# EAGLE design CET_GPS_5_03_22_new_route (EAGLE 9.6.2)
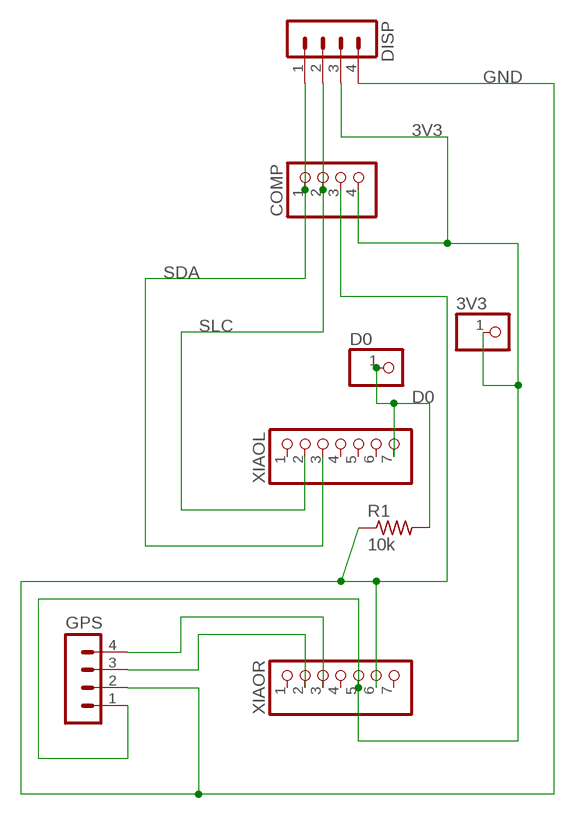
[diagram p0: schematic, sheet 1]

## Parts
3V3  PINHD-1X1  [1X01]
COMP  PINHD-1X4/90  [1X04/90]
D0  PINHD-1X1  [1X01]
DISP  MA04-1  [MA04-1]
GPS  MA04-1  [MA04-1]
R1  10k  R-US_0204/7  [0204/7]
XIAOL  PINHD-1X7  [1X07]
XIAOR  PINHD-1X7  [1X07]

## Nets
3V3: 3V3.1 COMP.4 DISP.3 GPS.1 XIAOR.5
D0: D0.1 R1.2 XIAOL.7
GND: COMP.3 DISP.4 GPS.2 R1.1 XIAOR.6
RX: GPS.3 XIAOR.2
SDA: COMP.1 DISP.1 XIAOL.3
SLC: COMP.2 DISP.2 XIAOL.2
TX: GPS.4 XIAOR.3
Unconnected: XIAOL.1 XIAOL.4 XIAOL.5 XIAOL.6 XIAOR.1 XIAOR.4 XIAOR.7

## Library data of the parts
3V3 D0 = pinhead:PINHD-1X1: PIN HEADER
COMP = pinhead:PINHD-1X4: PIN HEADER
DISP GPS = con-lstb:MA04-1: PIN HEADER; OC_FARNELL: unknown; OC_NEWARK: unknown
R1 = rcl:R-US_: RESISTOR, American symbol; SPICEPREFIX: R
XIAOL XIAOR = pinhead:PINHD-1X7: PIN HEADER

## Net classes
0 default: clearance 0.205 mm

## Board
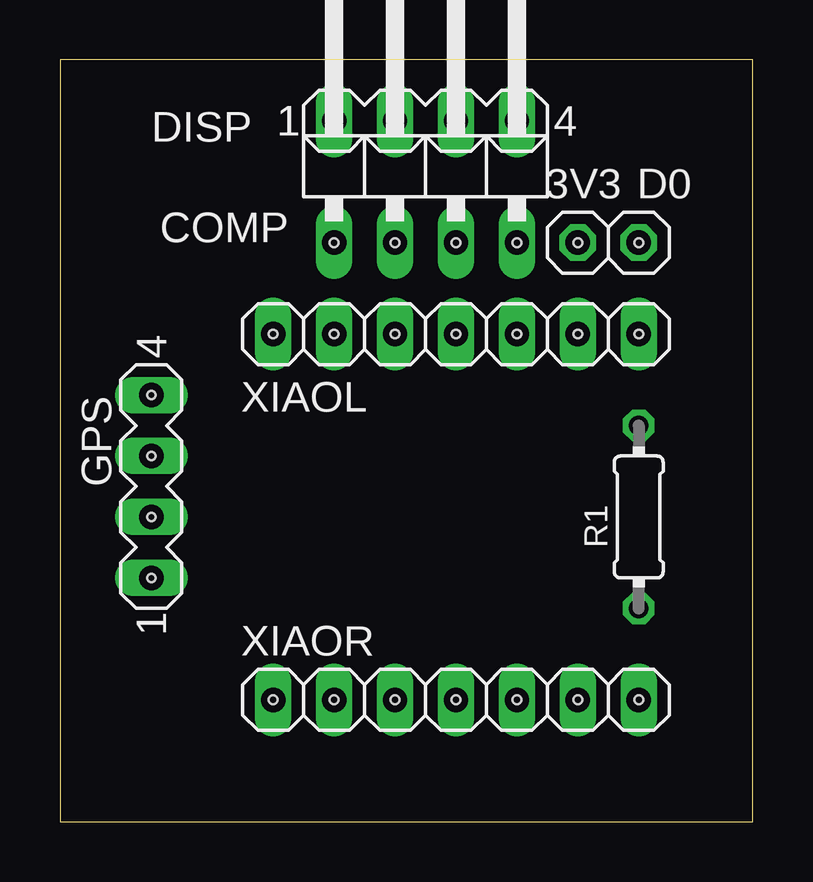
[diagram p1: board, top side]
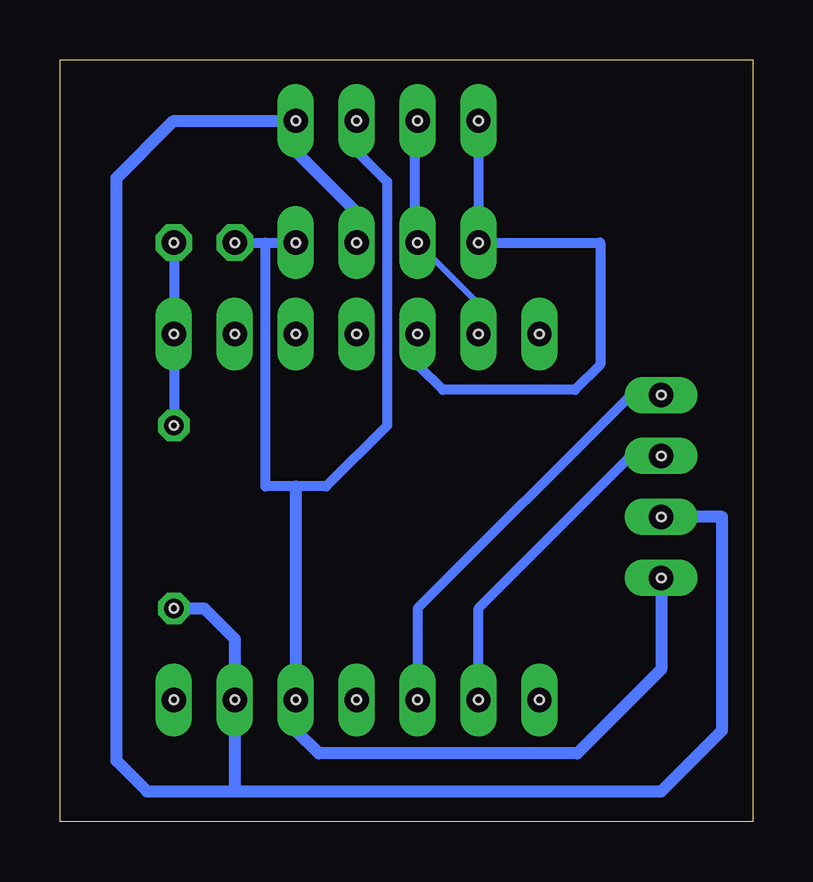
[diagram p2: board, bottom side, seen from below]

Size 28.88 x 31.74 mm. Coordinates in mm from the lower left corner, seen from the top.
Outline: 0,0 28.88,0 28.88,31.74 0,31.74 0,0
Copper layers (1*16): Top 0.035mm / dielectric 1.5mm / Bottom 0.035mm
Design rules "default": minimum track width 6mil, minimum drill 0.35mm, track to track 6mil, track to pad 6mil, pad to pad 6mil, via to via 6mil, smd to smd 6mil, copper to edge 40mil, drill to drill 6mil, minimum pad ring 10mil, minimum via ring 8mil, stop-mask expansion 4mil, vias tented up to drill 0mil, thermal gap 10mil
Holes 0.35 mm at 24.13,24.13 24.13,16.51 24.13,8.89 19.05,24.13 16.51,24.13 13.97,24.13 11.43,24.13 11.43,29.21 13.97,29.21 16.51,29.21 19.05,29.21 8.89,20.32 11.43,20.32 13.97,20.32 16.51,20.32 19.05,20.32 21.59,20.32 24.13,20.32 8.89,5.08 11.43,5.08 13.97,5.08 16.51,5.08 19.05,5.08 21.59,5.08 24.13,5.08 21.59,24.13 3.81,17.78 3.81,15.24 3.81,12.7 3.81,10.16

### Footprints (pad centres in the part's own frame; a part is rotated, then mirrored left to right if it is on the bottom)
1X01 = drill 1.016 octagon: 1 0,0
1X04/90 = drill 1.016 long: 1 -3.81,-3.81; 2 -1.27,-3.81; 3 1.27,-3.81; 4 3.81,-3.81
MA04-1 = drill 1.016 long: 1 -3.81,0; 2 -1.27,0; 3 1.27,0; 4 3.81,0
0204/7 = drill 0.813 octagon: 1 -3.81,0; 2 3.81,0
1X07 = drill 1.016 long: 1 -7.62,0; 2 -5.08,0; 3 -2.54,0; 4 0,0; 5 2.54,0; 6 5.08,0; 7 7.62,0

### Placement (x,y rotation side)
3V3  21.59,24.13 0 top
COMP  15.24,27.94 0 top
D0  24.13,24.13 0 top
DISP  15.24,29.21 0 top
GPS  3.81,13.97 90 top
R1  24.13,12.7 90 top
XIAOL  16.51,20.32 0 top
XIAOR  16.51,5.08 0 top

### Tracks (layer width: path | path; a pad name or v marks a point on that pad's centre or on a via)
3V3
  Bottom 0.152: COMP.4 20.32,24.13
  Bottom 0.406: 20.32,24.13 20.32,13.97 19.05,13.97 17.78,13.97 15.24,16.51 15.24,26.67 16.51,27.94 DISP.3 | 3V3.1 COMP.4
  Bottom 0.508: GPS.1 3.81,6.35 7.32,2.85 18.09,2.85 19.05,3.81 XIAOR.5 19.05,13.97
D0
  Bottom 0.406: R1.2 XIAOL.7 D0.1
GND
  Bottom 0.508: R1.1 22.86,8.89 21.59,7.62 XIAOR.6 21.59,1.27 | COMP.3 16.51,25.4 19.05,27.94 DISP.4 24.13,29.21 26.52,26.82 26.52,2.54 25.25,1.27 21.59,1.27 | GPS.2 1.27,12.7 1.27,3.81 3.81,1.27 21.59,1.27
RX
  Bottom 0.406: GPS.3 5.08,15.24 11.43,8.89 XIAOR.2
SDA
  Bottom 0.406: DISP.1 COMP.1 6.35,24.13 6.35,19.05 7.4,18 12.92,18 13.97,19.05 XIAOL.3
SLC
  Bottom 0.152: 14.07,29.16 DISP.2 | COMP.2 14.07,24.13
  Bottom 0.254: COMP.2 11.43,21.59 XIAOL.2
  Bottom 0.406: 14.07,24.13 14.07,29.16
TX
  Bottom 0.152: 13.97,6.35
  Bottom 0.254: XIAOR.3 13.97,6.35
  Bottom 0.406: GPS.4 5.08,17.78 13.97,8.89 13.97,6.35